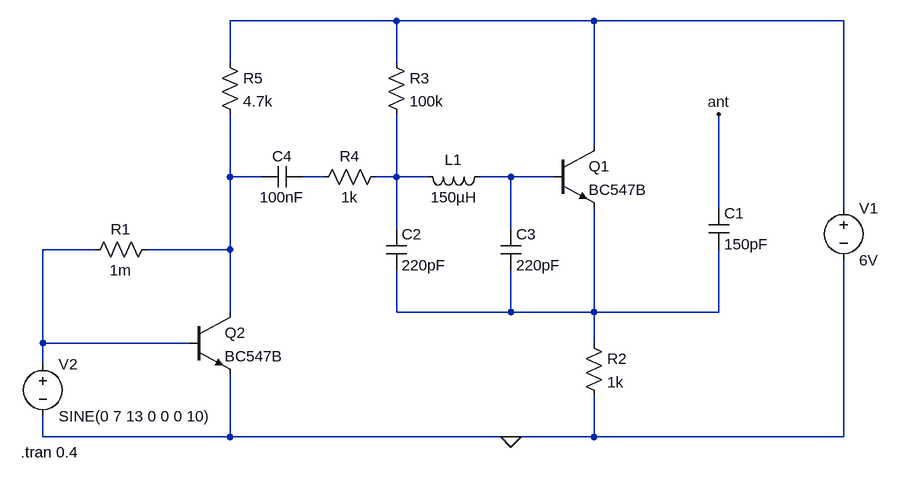
[diagram p0: schematic simple_am_transmitter_bc547_x2.asc]
simple_am_transmitter_bc547_x2.asc, the LTspice schematic file:
Version 4
SHEET 1 880 680
WIRE 0 -96 -256 -96
WIRE 304 -96 0 -96
WIRE 688 -96 304 -96
WIRE -256 -32 -256 -96
WIRE 0 -32 0 -96
WIRE 304 96 304 -96
WIRE -256 144 -256 48
WIRE -208 144 -256 144
WIRE -112 144 -144 144
WIRE 0 144 0 48
WIRE 0 144 -32 144
WIRE 48 144 0 144
WIRE 176 144 128 144
WIRE 240 144 176 144
WIRE 496 192 496 48
WIRE 688 192 688 -96
WIRE 0 224 0 144
WIRE 176 224 176 144
WIRE -464 256 -544 256
WIRE -256 256 -256 144
WIRE -256 256 -384 256
WIRE -256 352 -256 256
WIRE 0 352 0 288
WIRE 176 352 176 288
WIRE 176 352 0 352
WIRE 304 352 304 192
WIRE 304 352 176 352
WIRE 496 352 496 256
WIRE 496 352 304 352
WIRE -544 400 -544 256
WIRE -320 400 -544 400
WIRE 304 400 304 352
WIRE -544 432 -544 400
WIRE -544 544 -544 512
WIRE -256 544 -256 448
WIRE -256 544 -544 544
WIRE 176 544 -256 544
WIRE 304 544 304 480
WIRE 304 544 176 544
WIRE 688 544 688 272
WIRE 688 544 304 544
FLAG 496 48 ant
FLAG 176 544 0
SYMBOL npn 240 96 R0
SYMATTR InstName Q1
SYMATTR Value BC547B
SYMBOL npn -320 352 R0
SYMATTR InstName Q2
SYMATTR Value BC547B
SYMBOL res -368 240 R90
WINDOW 0 0 56 VBottom 2
WINDOW 3 32 56 VTop 2
SYMATTR InstName R1
SYMATTR Value 1m
SYMBOL res 288 384 R0
SYMATTR InstName R2
SYMATTR Value 1k
SYMBOL res -16 -48 R0
SYMATTR InstName R3
SYMATTR Value 100k
SYMBOL res -16 128 R90
WINDOW 0 0 56 VBottom 2
WINDOW 3 32 56 VTop 2
SYMATTR InstName R4
SYMATTR Value 1k
SYMBOL voltage 688 176 R0
WINDOW 123 0 0 Left 0
WINDOW 39 0 0 Left 0
SYMATTR InstName V1
SYMATTR Value 6V
SYMBOL cap 480 192 R0
SYMATTR InstName C1
SYMATTR Value 150pF
SYMBOL cap -16 224 R0
SYMATTR InstName C2
SYMATTR Value 220pF
SYMBOL cap 160 224 R0
SYMATTR InstName C3
SYMATTR Value 220pF
SYMBOL ind 144 128 R90
WINDOW 0 5 56 VBottom 2
WINDOW 3 32 56 VTop 2
SYMATTR InstName L1
SYMATTR Value 150µH
SYMBOL cap -144 128 R90
WINDOW 0 0 32 VBottom 2
WINDOW 3 32 32 VTop 2
SYMATTR InstName C4
SYMATTR Value 100nF
SYMBOL res -272 -48 R0
SYMATTR InstName R5
SYMATTR Value 4.7k
SYMBOL voltage -544 416 R0
WINDOW 123 0 0 Left 0
WINDOW 39 0 0 Left 0
SYMATTR InstName V2
SYMATTR Value SINE(0 7 13 0 0 0 10)
TEXT -578 568 Left 2 !.tran 0.4

The netlist it stands for:
* simple_am_transmitter_bc547_x2.asc
Q1 N001 N005 N007 0 BC547B
Q2 N002 N006 0 0 BC547B
R1 N002 N006 1m
R2 N007 0 1k
R3 N001 N004 100k
R4 N004 N003 1k
V1 N001 0 6V
C1 ant N007 150pF
C2 N004 N007 220pF
C3 N005 N007 220pF
L1 N005 N004 150µH
C4 N003 N002 100nF
R5 N001 N002 4.7k
V2 N006 0 SINE(0 7 13 0 0 0 10)
.model NPN NPN
.model PNP PNP
.lib standard.bjt
.tran 0.4
.backanno
.end